# Altium project PCB_Project_POW.PrjPcb (part 1 of 2)
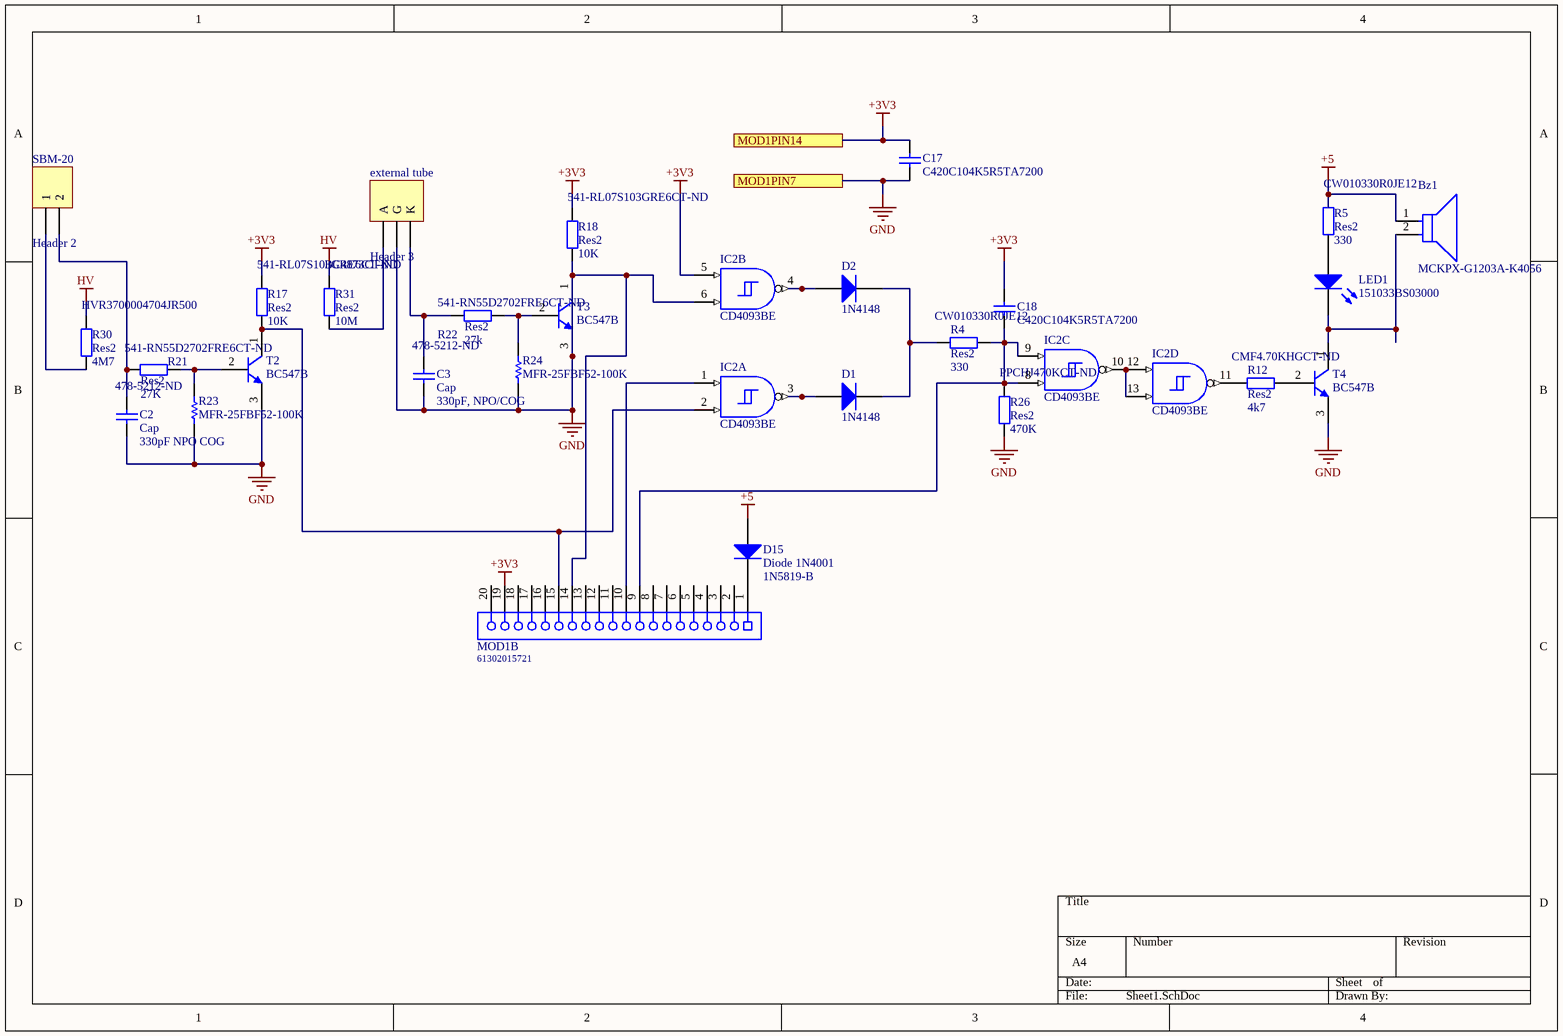
[diagram p0: Sheet1.SchDoc]
3 sheets, 105 parts. Net scope: flat (ports and power ports of the same name join across sheets).
Board file: PCB1.PcbDoc
Sheets:
  Sheet1.SchDoc
  Sheet2.SchDoc
  Sheet3.SchDoc

## Sheet Sheet1.SchDoc
size A4; SheetNumber: 1; SheetTotal: 2

### Parts
Bz1  MCKPX-G1203A-K4056  [FP-MCKPX-G1203A-K4056-MFG]
C2  Cap  value 330pF NPO COG  Supplier Part Number 1: 478-5212-ND  [RAD-0.3]
C3  Cap  value 330pF, NPO/COG  Supplier Part Number 1: 478-5212-ND  [RAD-0.3]
C17  C420C104K5R5TA7200  [KEMT-C420C104K5R5TA7200-2]
C18  C420C104K5R5TA7200  [KEMT-C420C104K5R5TA7200-2]
D1  1N4148  [NXP-SOD27-2_V]
D2  1N4148  [NXP-SOD27-2_V]
D15  Diode 1N4001  Supplier Part Number 1: 1N5819-B  [DO-41]
external_tube  Header 3  [HDR1X3]
IC2  CD4093BE  [N0014A]  (parts A,B,C,D of 5)
LED1  151033BS03000  [Type 3mm]
MOD1B  61302015721  [61302015721]
R4  Res2  value 330  Supplier Part Number 1: CW010330R0JE12  [AXIAL-0.4]
R5  Res2  value 330  Supplier Part Number 1: CW010330R0JE12  [AXIAL-0.4]
R12  Res2  value 4k7  Supplier Part Number 1: CMF4.70KHGCT-ND  [AXIAL-0.4]
R17  Res2  value 10K  Supplier Part Number 1: 541-RL07S103GRE6CT-ND  [AXIAL-0.4]
R18  Res2  value 10K  Supplier Part Number 1: 541-RL07S103GRE6CT-ND  [AXIAL-0.4]
R21  Res2  value 27K  Supplier Part Number 1: 541-RN55D2702FRE6CT-ND  [AXIAL-0.4]
R22  Res2  value 27k  Supplier Part Number 1: 541-RN55D2702FRE6CT-ND  [AXIAL-0.4]
R23  MFR-25FBF52-100K  [RESA60-630X240]
R24  MFR-25FBF52-100K  [RESA60-630X240]
R26  Res2  value 470K  Supplier Part Number 1: PPCHJ470KCT-ND  [AXIAL-0.4]
R30  Res2  value 4M7  Supplier Part Number 1: HVR3700004704JR500  [AXIAL-0.4]
R31  Res2  value 10M  Supplier Part Number 1: BC4873CT-ND  [AXIAL-0.4]
SBM-20  Header 2  [HDR1X2]
T2  BC547B  [ONSC-TO-92-3-29-11]
T3  BC547B  [ONSC-TO-92-3-29-11]
T4  BC547B  [ONSC-TO-92-3-29-11]

### Ports
MOD1PIN7, MOD1PIN14

### Nets
+3V3: C17.2 C18.2 IC2.5(C) MOD1B.19 R17.2 R18.2 ; port MOD1PIN14
+5: Bz1.1(C) C2.1 C3.1 C17.1 D15.1(A) external_tube.G IC2.6(D) MOD1B.14 R5.1 R18.1 R23.1 R24.1 R26.1 T2.3(E) T3.1(C) T3.3(E) T4.3(E) ; port MOD1PIN7  [also labelled GND]
HV: R30.2 R31.2
NetBz1_2: Bz1.2(A) LED1.1(K) T4.1(C)
NetC2_2: C2.2 R21.1 SBM-20.2
NetC3_2: C3.2 external_tube.K R22.1
NetC18_1: C18.1 IC2.8(F) IC2.9(E) MOD1B.9 R4.2 R26.2
NetD1_1: D1.1(A) IC2.3(J)
NetD1_2: D1.2(K) D2.2(K) R4.1
NetD2_1: D2.1(A) IC2.4(K)
NetD15_2: D15.2(K) MOD1B.1
Netexternal_tube_A: external_tube.A R31.1
NetIC2_1: IC2.1(A) MOD1B.10
NetIC2_2: IC2.2(B) MOD1B.15 R17.1 T2.1(C)
NetIC2_10: IC2.10(L) IC2.12(G) IC2.13(H)
NetIC2_11: IC2.11(M) R12.1
NetLED1_2: LED1.2(A) R5.2
NetR12_2: R12.2 T4.2(B)
NetR21_2: R21.2 R23.2 T2.2(B)
NetR22_2: R22.2 R24.2 T3.2(B)
NetR30_1: R30.1 SBM-20.1

Not connected (* = marked no-connect by the designer): MOD1B 2 3 4 5 6 7 8 11 12 13 16 17 18 20

### Library data of the parts
Bz1 = CMP-12433-000001-1: MAGNETIC BUZZER AND TRANSDUCER - More Details; Manufacturer: Multicomp Pro; Operating Supply Voltage: 3V; Current: 30mA; Frequency: 2300Hz; Max Supply Voltage: 5V; Min Supply Voltage: 2V; Standoff Height: 0.5mm; ComponentLink2Description: Datasheet; ComponentLink2URL: http://www.farnell.com/datasheets/1498149.pdf?_ga=2.17855225.1157923166.1572356775-536200964.1569240579; Manufacturer Part Number: MCKPX-G1203A-K4056; Temperature Range High: +70°C; Device Class L2: Audio Products; Temperature Range Low: -20°C; Package: 0; Temperature: -20°C to +70°C; Category: Speak; Octopart: https://octopart.com/mckpx-g1203a-k4056-multicomp-12157154; RoHS: TRUE; Lead Free: Yes; Height: 9.5mm; Device Class L1: Electromechanical; Automotive: No; Device Class L3: Buzzers
C2 C3 = Cap: Multilayer Ceramic Capacitor, 330 pF, 100 V,  5%, Radial Leaded, C0G / NP0; Manufacturer: Kyocera AVX; Manufacturer Part Number: SR151A331JAR; Capacitance: 330pF; Voltage Rating: 100V; Voltage Rating (DC): 50V; Lead/Base Style: Straight; Temperature Coefficient: 30ppm/°C; Lead Diameter: 0.508mm; Published: 8-Jun-2000; LatestRevisionDate: 17-Jul-2002; LatestRevisionNote: Re-released for DXP Platform.; PackageReference: RAD-0.3; Publisher: Altium Limited; PackageDescription: Radial Cap, Thru-Hole; 2 Leads; 0.3 in Pin Spacing; Supplier 1: Digi-Key; RoHS: Yes; Category: Ceramic Capacitors; Stock 1: 1456; Pricing 1: 1=0,63000, 10=0,44200, 50=0,33420, 100=0,29110, 500=0,21560, 1000=0,18326, 2500=0,17248, 5000=0,16170 (USD); Mount: Through Hole,PCB; Case/Package: Dipped; Number of Pins: 2; Contact Plating: Tin,Matte; Min Operating Temperature: -55°C; Max Operating Temperature: 125°C; Tolerance: 5%; Packaging: Bulk; Dielectric: C0G; Termination: Radial; Package Quantity: 1000; Resistor Type: Ceramic; Voltage: 100V; Length: 3.81mm; Width: 0.1inch; Height: 3.81mm; Lead Pitch: 2.54mm; Thickness: 2.54mm; Depth: 2.54mm; Height - Seated (Max): 0.15inch; Radiation Hardening: No; RoHS Compliant: Yes; Lead Free: Lead Free; REACH SVHC: No SVHC; ComponentLink1URL: https://datasheet.ciiva.com/11787/0900766b8064818e-11787697.pdf?src-supplier=RSComponents; ComponentLink1Description: https://datasheet.ciiva.com/11787/0900766b8064818e-11787697.pdf?src-supplier=RSComponents; ComponentLink2URL: https://datasheet.ciiva.com/27051/1129391-27051478.pdf?src-supplier=Jameco; ComponentLink2Description: https://datasheet.ciiva.com/27051/1129391-27051478.pdf?src-supplier=Jameco; ComponentLink3URL: https://datasheet.ciiva.com/154/skycap-154577.pdf?src-supplier=Digi-Key; ComponentLink3Description: https://datasheet.ciiva.com/154/skycap-154577.pdf?src-supplier=Digi-Key; ComponentLink4URL: https://datasheet.ciiva.com/16391/skycap-sr-16391048.pdf?src-supplier=Future+Electronics; ComponentLink4Description: https://datasheet.ciiva.com/16391/skycap-sr-16391048.pdf?src-supplier=Future+Electronics; ComponentLink5URL: https://datasheet.ciiva.com/14587/70195658-14587500.pdf?src-supplier=Allied+Electronics; ComponentLink5Description: https://datasheet.ciiva.com/14587/70195658-14587500.pdf?src-supplier=Allied+Electronics; ComponentLink6URL: https://datasheet.ciiva.com/22620/210648-22620069.pdf?src-supplier=Element14; ComponentLink6Description: https://datasheet.ciiva.com/22620/210648-22620069.pdf?src-supplier=Element14; ComponentLink7URL: https://datasheet.ciiva.com/5389/skycap-sr-8826-5389254.pdf?src-supplier=Mouser; ComponentLink7Description: https://datasheet.ciiva.com/5389/skycap-sr-8826-5389254.pdf?src-supplier=Mouser
C17 C18 = CMP-2000-05175-1: CAP, Ceramic, 0.1 uF, +/- 10%, 50 V, -55 to 125 degC, 2-Pin THD, RoHS, Tape and Reel; Manufacturer: KEMET; Capacitance Value: 0.1uF; Dielectric: X7R; Product Diameter: 2.54(Max)mm; Rad Hard: No; Product Length: 6.6(Max)mm; Voltage: 50Vdc; Tolerance: 10%; Package Description: 3-Pin Through Hole Device, Body 7.36 x 2.54 mm, Pitch 11.04 mm; Category: CapacitorCeramicMultilayer; Operating Temperature: -55to125degC; Termination Style: Axial; Manufacturer URL: http://www.kemet.com/; Mounting: ThroughHole; Datasheet URL: http://www.mouser.com/ds/2/212/Kemet_C410-412-420-364989.pdf; Package/Case: 2.54(Max)X6.6(Max); Datasheet Version: Aug-14
D1 D2 = CMP-0648-00002-1: High-speed Diode, 100 V, 450 mA, 2-Pin SOD27, RoHS; Manufacturer: NXP Semiconductors; Configuration: Single; IR (VR: 20 V)=25 nA; IFRM: 450 mA; IFSM: 4 A Max.; Trr: 4 ns Max.; Cd: 4 pF Max.; VR: 100 V Max.; VF (IF: 10 mA)=1 V; IF: 200 mA Max.; ComponentLink1Description: Manufacturer URL; RoHS: TRUE; ComponentLink1URL: http://www.nxp.com/; ComponentLink3Description: Package Specification; DatasheetVersion: Aug-04; ComponentLink2Description: Datasheet; PackageVersion: Aug-04; PackageReference: SOD27; ComponentLink3URL: http://www.nxp.com/documents/data_sheet/1N4148_1N4448.pdf; Mounting Technology: Through Hole; ComponentLink2URL: http://www.nxp.com/documents/data_sheet/1N4148_1N4448.pdf; PartNumber: 1N4148; PackageDescription: 2-Pin Hermetically Sealed Glass Package, Axial Leaded, Dia 1.85 mm, Body Length 4.25 mm, Lead Spread 25.4 mm
D15 = Diode 1N4001: Diode Schottky 40V 1A 2-Pin DO-41 Bulk; Manufacturer: Diodes Zetex; Forward Voltage: 900mV; Max Reverse Current: 1mA; Element Configuration: Single; Peak Non-Repetitive Surge Current: 25A; Published: 8-Jun-2000; LatestRevisionDate: 17-Jul-2002; LatestRevisionNote: Re-released for DXP Platform.; DatasheetVersion: 1998; PackageVersion: Aug-1999; PackageReference: DO-41; Publisher: Altium Limited; PackageDescription: Diode, Axial; Body 5.2 x 2.7 mm (LxDia. max), Lead Dia. 0.86 mm (max); Code_JEDEC: DO-204-AL; ComponentLink1Description: Manufacturer Link; ComponentLink1URL: http://www.fairchildsemi.com/; ComponentLink2Description: Datasheet; ComponentLink2URL: http://www.fairchildsemi.com/ds/1N%2F1N4001.pdf; Supplier 1: Avnet; Manufacturer Part Number: 1N5819-B; RoHS: Yes; Category: Rectifier Diodes; Pricing 1: 1000=0,03882, 2000=0,03743, 4000=0,03631, 6000=0,03525, 8000=0,03392, 10000=0,03339, 100000=0,03286 (USD); Mount: Through Hole; Case/Package: DO-41; Number of Pins: 2; Weight: 0.010935oz; Contact Plating: Tin; Min Operating Temperature: -65°C; Max Operating Temperature: 125°C; Packaging: Bulk; Average Rectified Current: 1A; Package Quantity: 1000; Max Repetitive Reverse Voltage (Vrrm): 40V; Max Reverse Voltage (DC): 40V; Forward Current: 1A; Max Forward Surge Current (Ifsm): 25A; Series: 1N58; Length: 5.21mm; Width: 2.72mm; Height: 2.72mm; Radiation Hardening: No; RoHS Compliant: Yes; ComponentLink3URL: https://datasheet.ciiva.com/912/ds23001-912768.pdf?src-supplier=Avnet; ComponentLink3Description: https://datasheet.ciiva.com/912/ds23001-912768.pdf?src-supplier=Avnet
external_tube = Header 3: Header, 3-Pin; LatestRevisionDate: 17-Jul-2002; LatestRevisionNote: Re-released for DXP Platform.; Publisher: Altium Limited
IC2 = CMP-1627-00493-3: CMOS Quad 2-Input NAND Schmitt Triggers, N0014A, TUBE; Manufacturer: Texas Instruments; ICC @ Nom Voltage(Max)(mA): 0.06; VCC(Min)(V): 3; Rating: Catalog; Bits(#): 4; Technology Family: CD4000; Output Drive (IOL/IOH)(Max)(mA): 1.5/-1.5; VCC(Max)(V): 18; Voltage(Nom)(V): 10; Schmitt Trigger: Yes; F @ Nom Voltage(Max)(Mhz): 8; DatasheetVersion: SCHS115D; PackageReference: N0014A; Code_JEDEC: MS-001; Output Type: CMOS; Input Type: CMOS; Generic Part Number: CD4093B; Operating Temperature Range(C): -55 to 125
LED1 = CMP-1489-00002-1: THT LED round mono-color waterclear, WL-TMRW , Blue; Manufacturer: Wuerth Elektronik; ComponentLink2URL: http://katalog.we-online.de/pbs/datasheet/7448042001.pdfhttp://katalog.we-online.de/pbs/datasheet/7448042001.pdfhttp://katalog.we-online.de/pbs/datasheet/7448042001.pdfhttp://katalog.we-online.de/pbs/datasheet/151033BS03000.pdf; ComponentLink1Description: Manufacturer URL; Emitting color: Blue; PackageReference: Type 3mm; ComponentLink2Description: Datasheet; PartNumber: 151033BS03000; ComponentLink1URL: http://www.we-online.com
MOD1B = CMP-1502-01349-1: THT Vertical Socket Header WR-PHD, Pitch 2.54 mm, Single Row, 20 pins; Manufacturer: Wurth Elektronik; Withstanding Voltage: 500VAC; Working Voltage: 250VAC; Rated Current: 3A; Gender: Female; Pitch: 2.54mm; Contact Resistance: 20mOhm; Pin Number: 20; Operating Temperature: -40to125degC; Manufacturer URL: http://www.we-online.de; Datasheet URL: https://katalog.we-online.de/em/datasheet/6130xx15721.pdf; Row Number: Single; Packaging: Tube; Orientation: Vertical; Publisher: WurthElektronik; Package Reference: 61302015721; Mounting Technology: THT; Part Number: 61302015721
R4 R5 = Res2: Wirewound Resistors 10watts 330ohms 5%; Manufacturer: Vishay Dale; Resistance: 330R; Power Rating: 10W; Temperature Coefficient: 30ppm/°C; Lead Diameter: 1.02mm; Published: 8-Jun-2000; LatestRevisionDate: 17-Jul-2002; LatestRevisionNote: Re-released for DXP Platform.; PackageReference: AXIAL-0.4; Publisher: Altium Limited; PackageDescription: Axial Device, Thru-Hole; 2 Leads; 0.4 in Pin Spacing; Supplier 1: Avnet; Manufacturer Part Number: CW010330R0JE12; RoHS: Yes; Category: Through-Hole Resistors; Pricing 1: 100=1,22562, 200=1,19564, 400=1,09480, 600=1,06352, 800=1,04006, 1000=1,01660, 10000=0,99314 (USD); Mount: Through Hole; Case/Package: Axial; Weight: 0.317466oz; Contact Plating: Tin,Matte; Min Operating Temperature: -65°C; Max Operating Temperature: 250°C; Tolerance: 5%; Resistor Type: Wirewound; Packaging: Bulk; Package Quantity: 100; Number of Terminations: 2; Termination: Axial; Max Power Dissipation: 10W; Features: Moisture Resistant; Diameter: 9.52mm; Length: 47.62mm; Radiation Hardening: No; Military Standard: Not; ComponentLink1URL: https://datasheet.ciiva.com/8453/cw-8453255.pdf?src-supplier=Avnet; ComponentLink1Description: https://datasheet.ciiva.com/8453/cw-8453255.pdf?src-supplier=Avnet; ComponentLink2URL: https://datasheet.ciiva.com/2761/cw-2761098.pdf?src-supplier=Digi-Key; ComponentLink2Description: https://datasheet.ciiva.com/2761/cw-2761098.pdf?src-supplier=Digi-Key
R12 = Res2: METAL FILM RESISTOR, 4.7KOHM, 500mW, 1%; Product Range:CMF Series; Resistance:4.7kohm; Power Rating:500mW; Resistance Tolerance: 1%; Voltage Rating:250V; Resistor Case Style:Axial Leaded; Resistor Element Type:Metal Film ;RoHS Compliant: Yes; Manufacturer: Vishay Dale; Manufacturer Part Number: CMF554K7000FKEB; Resistance: 4.7kR; Temperature Coefficient: 100ppm/°C; Voltage Rating: 250V; Lead Diameter: 0.64mm; Published: 8-Jun-2000; LatestRevisionDate: 17-Jul-2002; LatestRevisionNote: Re-released for DXP Platform.; PackageReference: AXIAL-0.4; Publisher: Altium Limited; PackageDescription: Axial Device, Thru-Hole; 2 Leads; 0.4 in Pin Spacing; Supplier 1: Digi-Key; RoHS: Yes; Category: Through-Hole Resistors; Stock 1: 1586; Pricing 1: 1=0,53000, 10=0,40700, 25=0,30960, 50=0,23000, 100=0,17110, 250=0,14456, 500=0,12390 (USD); Case/Package: Axial; Number of Pins: 2; Contact Plating: Tin,Matte; Weight: 0.009877oz; Min Operating Temperature: -55°C; Max Operating Temperature: 175°C; Tolerance: 1%; Power Rating: 500mW; Resistor Type: Metal Film; Packaging: Tape and Reel; Package Quantity: 1; Number of Terminations: 2; Max Power Dissipation: 500mW; Termination: Axial; Voltage Rating (DC): 250V; Features: Moisture Resistant,Flame Retardant Coating; Series: CMF; Diameter: 2.29mm; Length: 6.1mm; Width: 2.29mm; REACH SVHC: Unknown; RoHS Compliant: Yes; Lead Free: Lead Free; ComponentLink1URL: https://datasheet.ciiva.com/8821/cmfind-8821141.pdf?src-supplier=Avnet; ComponentLink1Description: https://datasheet.ciiva.com/8821/cmfind-8821141.pdf?src-supplier=Avnet; ComponentLink2URL: https://datasheet.ciiva.com/6532/cmfind-6532695.pdf?src-supplier=Digi-Key; ComponentLink2Description: https://datasheet.ciiva.com/6532/cmfind-6532695.pdf?src-supplier=Digi-Key; ComponentLink3URL: https://datasheet.ciiva.com/6532/cmfind-6532697.pdf?src-supplier=Digi-Key; ComponentLink3Description: https://datasheet.ciiva.com/6532/cmfind-6532697.pdf?src-supplier=Digi-Key; ComponentLink4URL: https://datasheet.ciiva.com/16436/cmfind-16436747.pdf?src-supplier=Future+Electronics; ComponentLink4Description: https://datasheet.ciiva.com/16436/cmfind-16436747.pdf?src-supplier=Future+Electronics
R17 R18 = Res2: Metal Film Resistors 1/4watt 10Kohms 2%; Manufacturer: Vishay Dale; Manufacturer Part Number: RL07S103GRE6; Resistance: 10kR; Max Power Dissipation: 250mW; Temperature Coefficient: 200ppm/°C; Voltage Rating: 250V; Published: 8-Jun-2000; LatestRevisionDate: 17-Jul-2002; LatestRevisionNote: Re-released for DXP Platform.; PackageReference: AXIAL-0.4; Publisher: Altium Limited; PackageDescription: Axial Device, Thru-Hole; 2 Leads; 0.4 in Pin Spacing; Supplier 1: Digi-Key; RoHS: No; Category: Through-Hole Resistors; Stock 1: 976; Pricing 1: 1=0,66000, 10=0,47000, 25=0,36640, 50=0,31020, 100=0,24440, 250=0,20680, 500=0,16920 (USD); Mount: Through Hole; Case/Package: Axial; Contact Plating: Tin,Lead; Min Operating Temperature: -65°C; Max Operating Temperature: 175°C; Tolerance: 2%; Packaging: Tape and Reel; Resistor Type: Metal Film; Number of Terminations: 2; Package Quantity: 1000; Power Rating: 250mW; Series: Military, MIL-PRF-22684/01, RL07; Termination: Axial; Features: Moisture Resistant,Military,Flame Retardant Coating; Diameter: 2.29mm; Length: 0.24inch; Width: 2.29mm; RoHS Compliant: No; Lead Free: Contains Lead; Military Standard: MIL-PRF-22684; ComponentLink1URL: https://datasheet.ciiva.com/14072/cmfmil-14072105.pdf?src-supplier=Digi-Key; ComponentLink1Description: https://datasheet.ciiva.com/14072/cmfmil-14072105.pdf?src-supplier=Digi-Key
R21 R22 = Res2: RES 27K OHM 1/8W 1% AXIAL; Manufacturer: Vishay Dale; Manufacturer Part Number: RN55D2702FRE6; Resistance: 27kR; Max Power Dissipation: 125mW; Temperature Coefficient: 100ppm/°C; Voltage Rating: 200V; Lead Diameter: 0.64mm; Published: 8-Jun-2000; LatestRevisionDate: 17-Jul-2002; LatestRevisionNote: Re-released for DXP Platform.; PackageReference: AXIAL-0.4; Publisher: Altium Limited; PackageDescription: Axial Device, Thru-Hole; 2 Leads; 0.4 in Pin Spacing; Supplier 1: Digi-Key; RoHS: No; Category: Through-Hole Resistors; Stock 1: 127; Pricing 1: 1=0,53000, 10=0,40700, 25=0,30960, 50=0,23000, 100=0,17110, 250=0,14456, 500=0,12390 (USD); Case/Package: Axial; Min Operating Temperature: -65°C; Max Operating Temperature: 175°C; Tolerance: 1%; Resistor Type: Metal Film; Packaging: Tape and Reel; Number of Terminations: 2; Package Quantity: 1000; Power Rating: 125mW; Features: Moisture Resistant,Military,Flame Retardant Coating; Series: Military, MIL-R-10509/7, RN55; Termination: Axial; Length: 0.24inch; Width: 2.29mm; RoHS Compliant: No; Lead Free: Contains Lead; ComponentLink1URL: https://datasheet.ciiva.com/14071/cmfmil-14071638.pdf?src-supplier=Digi-Key; ComponentLink1Description: https://datasheet.ciiva.com/14071/cmfmil-14071638.pdf?src-supplier=Digi-Key
R23 R24 = CMP-1659-00073-1: Axial Resistor, 100 KOhm, +/- 1%, 0.25 W, -55 to 155 degC, 2-Pin THD, RoHS, Bulk; Voltage Rating: 250 V; Power Rating: 250 mW; Resistance: 475 Ohm; PackageDescription: 2-Pin Axial Lead, Dia 2.4 mm, Body Length 6.3 mm; PackageReference: MFR-25; Length: 0.248 inch; ComponentLink2Description: Datasheet; Packaging: Bulk; DatasheetVersion: Apr-13; Package Quantity: 200; Min Operating Temperature: -55 degC; ComponentLink2URL: http://www.yageo.com/documents/recent/Yageo%20LR_MFR_2013.pdf; RoHSCompliant: true; ComponentLink1URL: http://www.yageo.com/; Tolerance: 1%; Case\Package: Axial; Mount: Through Hole; ComponentLink1Description: Manufacturer URL; Max Operating Temperature: 155 degC
R26 = Res2: RES 470K OHM 1/2W 5% AXIAL; Manufacturer: Vishay BCcomponents; Manufacturer Part Number: HVR3700004703JR500; Resistance: 470kR; Power Rating: 500mW; Temperature Coefficient: 200ppm/°C; Voltage Rating: 3.5kV; Published: 8-Jun-2000; LatestRevisionDate: 17-Jul-2002; LatestRevisionNote: Re-released for DXP Platform.; PackageReference: AXIAL-0.4; Publisher: Altium Limited; PackageDescription: Axial Device, Thru-Hole; 2 Leads; 0.4 in Pin Spacing; Supplier 1: Digi-Key; RoHS: Yes; Category: Through-Hole Resistors; Stock 1: 3725; Pricing 1: 1=0,54000, 10=0,41100, 25=0,31280, 50=0,23240, 100=0,17280, 250=0,14600, 500=0,12516, 1000=0,09536 (USD); Case/Package: Axial; Number of Pins: 2; Min Operating Temperature: -55°C; Max Operating Temperature: 155°C; Tolerance: 5%; Resistor Type: Metal Film; Packaging: Tape and Reel; Number of Terminations: 2; Max Power Dissipation: 500mW; Series: HVR37; Voltage Rating (DC): 3.5kV; Package Quantity: 1; Resistance Tolerance: 5%; Features: Flame Retardant Coating; Length: 0.394inch; RoHS Compliant: Yes; REACH SVHC: Unknown; Lead Free: Lead Free; ComponentLink1URL: https://datasheet.ciiva.com/2711/hvr2537-2711908.pdf?src-supplier=Digi-Key; ComponentLink1Description: https://datasheet.ciiva.com/2711/hvr2537-2711908.pdf?src-supplier=Digi-Key; ComponentLink2URL: https://datasheet.ciiva.com/2711/hvr2537-2711909.pdf?src-supplier=Digi-Key; ComponentLink2Description: https://datasheet.ciiva.com/2711/hvr2537-2711909.pdf?src-supplier=Digi-Key
R30 = Res2: RES 4.7M OHM 1/2W 5% AXIAL; Manufacturer: Vishay BCcomponents; Resistance: 4.7MR; Max Power Dissipation: 500mW; Temperature Coefficient: 200ppm/°C; Voltage Rating: 3.5kV; Published: 8-Jun-2000; LatestRevisionDate: 17-Jul-2002; LatestRevisionNote: Re-released for DXP Platform.; PackageReference: AXIAL-0.4; Publisher: Altium Limited; PackageDescription: Axial Device, Thru-Hole; 2 Leads; 0.4 in Pin Spacing; Supplier 1: Arrow Electronics; Manufacturer Part Number: HVR3700004704JR500; RoHS: Yes; Category: Through-Hole Resistors; Stock 1: 1607; Pricing 1: 1=0,55200, 10=0,42080, 25=0,31700, 50=0,23310, 100=0,17160, 250=0,14340, 500=0,12170, 1000=0,09170, 5000=0,07430, 1=0,25800, 10=0,19670, 25=0,14820, 100=0,08110, 250=0,08040, 500=0,07960, 1000=0,07890 (USD); Case/Package: Axial; Number of Pins: 2; Min Operating Temperature: -55°C; Max Operating Temperature: 155°C; Tolerance: 5%; Resistor Type: Metal Film; Packaging: Tape and Reel; Number of Terminations: 2; Series: HVR37; Package Quantity: 1; Power Rating: 500mW; Voltage Rating (DC): 3.5kV; Features: Flame Retardant Coating; Resistance Tolerance: 5%; Length: 0.394inch; RoHS Compliant: Yes; REACH SVHC: Unknown; Lead Free: Lead Free; ComponentLink1URL: https://datasheet.ciiva.com/2711/hvr2537-2711956.pdf?src-supplier=Digi-Key; ComponentLink1Description: https://datasheet.ciiva.com/2711/hvr2537-2711956.pdf?src-supplier=Digi-Key; ComponentLink2URL: https://datasheet.ciiva.com/2711/hvr2537-2711957.pdf?src-supplier=Digi-Key; ComponentLink2Description: https://datasheet.ciiva.com/2711/hvr2537-2711957.pdf?src-supplier=Digi-Key; ComponentLink3URL: https://datasheet.ciiva.com/7836/653840-7836134.pdf?src-supplier=Element14; ComponentLink3Description: https://datasheet.ciiva.com/7836/653840-7836134.pdf?src-supplier=Element14
R31 = Res2: Metal Film Resistors - Through Hole 1/4watt 1.5Mohms 5%; Manufacturer: Vishay; Manufacturer Part Number: VR25000001504JA100; Power Rating: 250mW; Resistance: 1.5MR; Voltage Rating: 1.6kV; Temperature Coefficient: 200ppm/°C; Published: 8-Jun-2000; LatestRevisionDate: 17-Jul-2002; LatestRevisionNote: Re-released for DXP Platform.; PackageReference: AXIAL-0.4; Publisher: Altium Limited; PackageDescription: Axial Device, Thru-Hole; 2 Leads; 0.4 in Pin Spacing; Supplier 1: Digi-Key; RoHS: Yes; Category: Through-Hole Resistors; Stock 1: 10358; Pricing 1: 1=0,42000, 10=0,30200, 25=0,22320, 50=0,16440, 100=0,12080, 250=0,09976, 500=0,08224 (USD); Mount: Through Hole; Case/Package: Conformal; Contact Plating: Tin; Min Operating Temperature: -55°C; Max Operating Temperature: 155°C; Tolerance: 5%; Termination: Axial; Packaging: Ammo Pack; Series: VR25; Construction: Cylindrical; Diameter: 2.5mm; Length: 7.5mm; Radiation Hardening: No; Military Standard: Not; RoHS Compliant: Yes; ComponentLink1URL: https://datasheet.ciiva.com/11825/0900766b80d81dee-11825367.pdf?src-supplier=RSComponents; ComponentLink1Description: https://datasheet.ciiva.com/11825/0900766b80d81dee-11825367.pdf?src-supplier=RSComponents; ComponentLink2URL: https://datasheet.ciiva.com/8394/vr25-8394076.pdf?src-supplier=Avnet; ComponentLink2Description: https://datasheet.ciiva.com/8394/vr25-8394076.pdf?src-supplier=Avnet; ComponentLink3URL: https://datasheet.ciiva.com/17051/vr25-17051452.pdf?src-supplier=Avnet+Europe; ComponentLink3Description: https://datasheet.ciiva.com/17051/vr25-17051452.pdf?src-supplier=Avnet+Europe
SBM-20 = Header 2: Header, 2-Pin; LatestRevisionDate: 17-Jul-2002; LatestRevisionNote: Re-released for DXP Platform.; Publisher: Altium Limited
T2-T4 = CMP-1048-01467-1: Amplifier Transistor, NPN Silicon, 3-Pin TO-92, Bulk Box; Manufacturer: On Semiconductor; IC Continuous (A): 0.1; fT Min (MHz): 150; DatasheetVersion: Rev. 7; ComponentLink1URL: http://www.onsemi.com/; Polarity: NPN; RoHS: FALSE; ComponentLink1Description: Manufacturer URL; Packing: Bulk Box; PackageDescription: 3-Pin Transistor Outline, Body 4.825 x 3.685 mm, Pitch 1.27 mm; ComponentLink3URL: http://www.onsemi.cn/pub_link/Collateral/2N6426-D.PDF; ComponentLink2Description: Datasheet; PackageVersion: Rev. AM; PackageReference: TO-92-3-29-11_AM_SL; ComponentLink3Description: Package Specification; Mounting Technology: Through Hole; PartNumber: BC547B; ComponentLink2URL: http://www.onsemi.com/pub_link/Collateral/BC546-D.PDF

## Sheet Sheet2.SchDoc
size A4; SheetNumber: 2; SheetTotal: 3
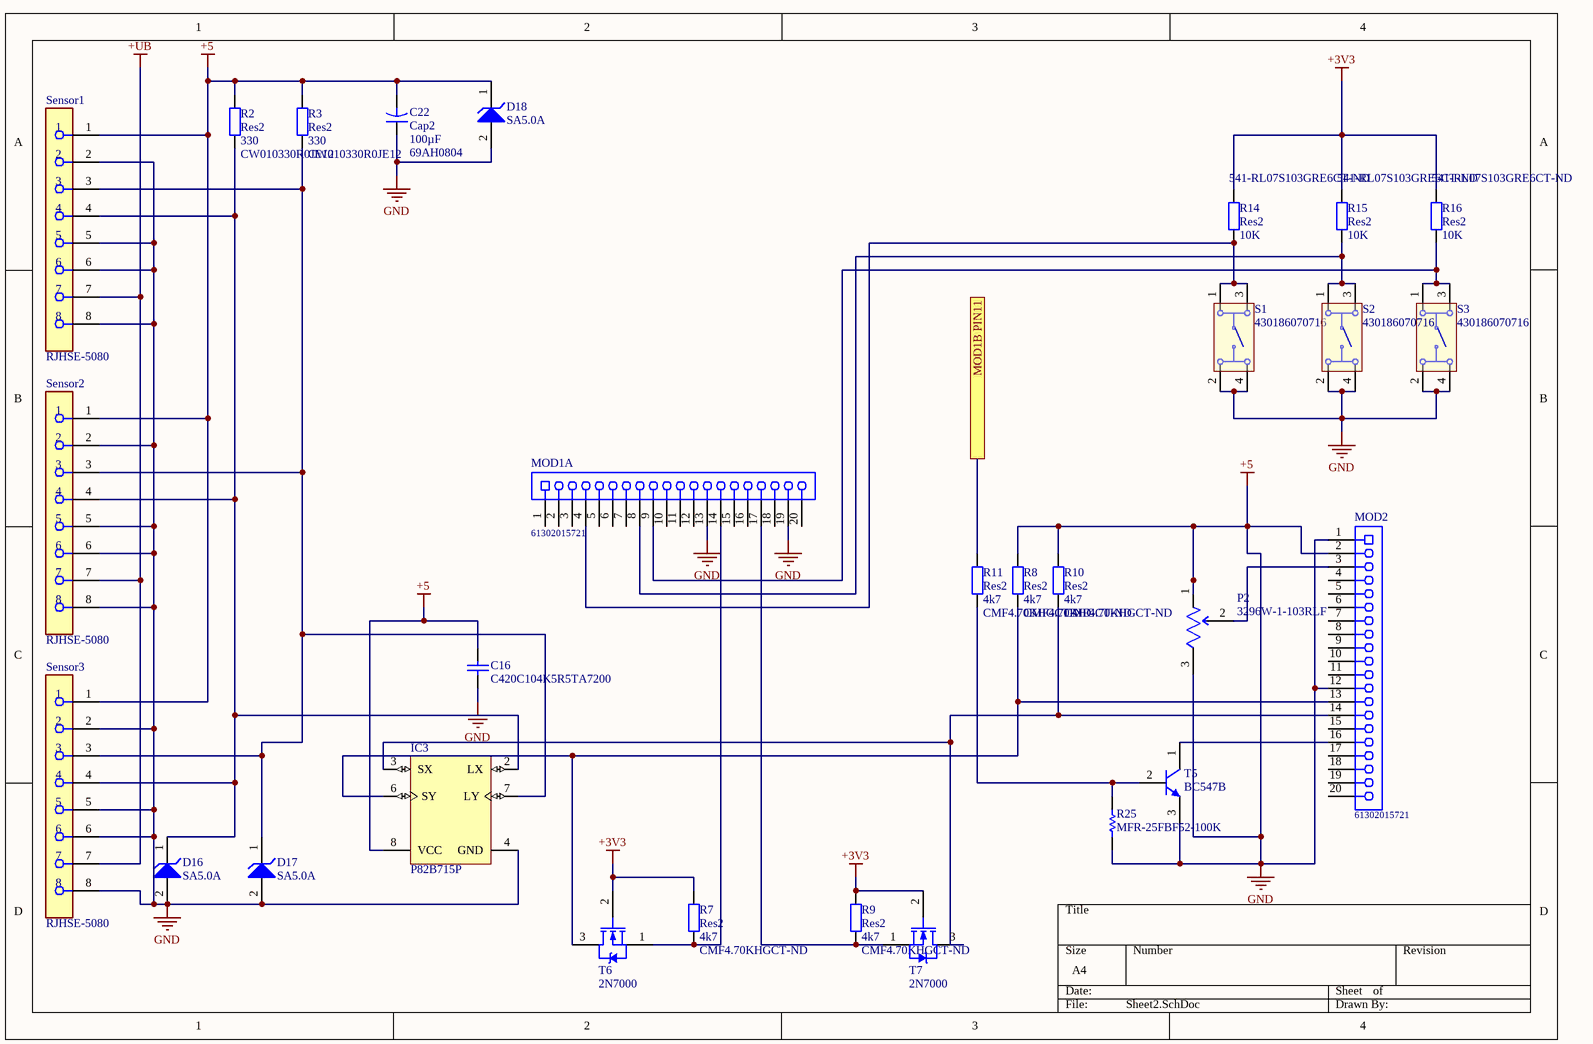
[diagram p1: Sheet2.SchDoc]

### Parts
C16  C420C104K5R5TA7200  [KEMT-C420C104K5R5TA7200-2]
C22  Cap2  value 100µF  Supplier Part Number 1: 69AH0804  [CAPR5-4X5]
D16  SA5.0A  [ONSC-AXIAL_LEAD-2-59AA-01_P]
D17  SA5.0A  [ONSC-AXIAL_LEAD-2-59AA-01_P]
D18  SA5.0A  [ONSC-AXIAL_LEAD-2-59AA-01_P]
IC3  P82B715P  [P0008A]
MOD1A  61302015721  [61302015721]
MOD2  61302015721  [61302015721]
P2  3296W-1-103RLF  [FP-3296W-MFG]
R2  Res2  value 330  Supplier Part Number 1: CW010330R0JE12  [AXIAL-0.4]
R3  Res2  value 330  Supplier Part Number 1: CW010330R0JE12  [AXIAL-0.4]
R7  Res2  value 4k7  Supplier Part Number 1: CMF4.70KHGCT-ND  [AXIAL-0.4]
R8  Res2  value 4k7  Supplier Part Number 1: CMF4.70KHGCT-ND  [AXIAL-0.4]
R9  Res2  value 4k7  Supplier Part Number 1: CMF4.70KHGCT-ND  [AXIAL-0.4]
R10  Res2  value 4k7  Supplier Part Number 1: CMF4.70KHGCT-ND  [AXIAL-0.4]
R11  Res2  value 4k7  Supplier Part Number 1: CMF4.70KHGCT-ND  [AXIAL-0.4]
R14  Res2  value 10K  Supplier Part Number 1: 541-RL07S103GRE6CT-ND  [AXIAL-0.4]
R15  Res2  value 10K  Supplier Part Number 1: 541-RL07S103GRE6CT-ND  [AXIAL-0.4]
R16  Res2  value 10K  Supplier Part Number 1: 541-RL07S103GRE6CT-ND  [AXIAL-0.4]
R25  MFR-25FBF52-100K  [RESA60-630X240]
S1  430186070716  [430186070716]
S2  430186070716  [430186070716]
S3  430186070716  [430186070716]
Sensor1  RJHSE-5080  [FP-RJHSE-5080-MFG]
Sensor2  RJHSE-5080  [FP-RJHSE-5080-MFG]
Sensor3  RJHSE-5080  [FP-RJHSE-5080-MFG]
T5  BC547B  [ONSC-TO-92-3-29-11]
T6  2N7000  [ONSC-TO-92-3-29-11]
T7  2N7000  [ONSC-TO-92-3-29-11]

### Ports
MOD1B PIN11

### Nets
+3V3: R7.2 R9.1 R14.2 R15.2 R16.2 T6.2(G) T7.2(G)
+5: C16.1 C16.2 C22.1 C22.2 D16.2(A) D17.2(A) D18.1(K) D18.2(A) IC3.4(GND) IC3.8(VCC) MOD1A.13 MOD1A.19 MOD2.1 MOD2.2 MOD2.12 P2.1(CCW) P2.3(CW) R2.2 R3.2 R8.1 R10.1 R25.1 S1.2 S1.4 S2.2 S2.4 S3.2 S3.4 Sensor1.1 Sensor1.2 Sensor1.5 Sensor1.6 Sensor1.8 Sensor2.1 Sensor2.2 Sensor2.5 Sensor2.6 Sensor2.8 Sensor3.1 Sensor3.2 Sensor3.5 Sensor3.6 Sensor3.8 T5.3(E)  [also labelled GND]
+UB: Sensor1.7 Sensor2.7 Sensor3.7
NetD16_1: D16.1(K) IC3.2(LX) R2.1 Sensor1.4 Sensor2.4 Sensor3.4
NetD17_1: D17.1(K) IC3.7(LY) R3.1 Sensor1.3 Sensor2.3 Sensor3.3
NetIC3_3: IC3.3(SX) MOD2.14 R10.2 T7.3(D)
NetIC3_6: IC3.6(SY) MOD2.13 R8.2 T6.3(D)
NetMOD1A_4: MOD1A.4 R14.1 S1.1 S1.3
NetMOD1A_8: MOD1A.8 R15.1 S2.1 S2.3
NetMOD1A_9: MOD1A.9 R16.1 S3.1 S3.3
NetMOD1A_14: MOD1A.14 R7.1 T6.1(S)
NetMOD1A_17: MOD1A.17 R9.2 T7.1(S)
NetMOD2_3: MOD2.3 P2.2(WIPER)
NetMOD2_16: MOD2.16 T5.1(C)
NetR11_1: R11.1 ; port MOD1B PIN11
NetR11_2: R11.2 R25.2 T5.2(B)

Not connected (* = marked no-connect by the designer): MOD1A 1 2 3 5 6 7 10 11 12 15 16 18 20; MOD2 4 5 6 7 8 9 10 11 15 17 18 19 20

### Library data of the parts
C16 = CMP-2000-05175-1: as C17 on sheet Sheet1; Tolerance: 10%; Package Description: 3-Pin Through Hole Device, Body 7.36 x 2.54 mm, Pitch 11.04 mm; Category: CapacitorCeramicMultilayer; Operating Temperature: -55to125degC; Termination Style: Axial; Manufacturer URL: http://www.kemet.com/; Mounting: ThroughHole; Datasheet URL: http://www.mouser.com/ds/2/212/Kemet_C410-412-420-364989.pdf; Package/Case: 2.54(Max)X6.6(Max); Datasheet Version: Aug-14
C22 = Cap2: Cap Aluminum 100uF 25V 20% (6.3 X 11mm) Radial 5mm 190mA 2500 hr 85C Ammo Pack; Manufacturer: Vishay BCcomponents; Manufacturer Part Number: MAL203836101E3; Life (Hours): 2500Hour; Leakage Current: 25uA; Dissipation Factor: 0.14%; Lead Diameter: 0.5mm; Published: 23-Sep-2002; PackageReference: CAPR5-4X5; Publisher: Altium Limited; PackageDescription: Capacitor; 2 Leads; Supplier 1: Newark; RoHS: Yes; Category: Aluminum Electrolytic Capacitors; Stock 1: 9020; Pricing 1: 10=0,22900, 25=0,22100, 50=0,21300, 100=0,20400 (USD); Mount: Through Hole; Case/Package: Radial; Weight: 0.021164oz; Min Operating Temperature: -40°C; Max Operating Temperature: 85°C; Capacitance: 100uF; Tolerance: 20%; Voltage Rating: 25V; Packaging: Tape and Reel; Ripple Current: 190mA; Termination: Radial; Package Quantity: 10000; Voltage Rating (DC): 25V; Series: 038 RSU; Diameter: 6.3mm; Length: 11mm; Height: 11mm; Height - Seated (Max): 0.492inch; Lead Pitch: 5mm; Radiation Hardening: No; RoHS Compliant: Yes; ComponentLink1URL: https://datasheet.ciiva.com/11701/038rsu-11701167.pdf?src-supplier=Avnet; ComponentLink1Description: https://datasheet.ciiva.com/11701/038rsu-11701167.pdf?src-supplier=Avnet
D16-D18 = CMP-1061-00012-1: 500 W Peak Power, MiniMOSORB(TM) Zener Transient Voltage Suppressor, Unidirectional, 2-Pin Axial_Lead, Bulk Box; Manufacturer: On Semiconductor; V(BR) Typ (V): 6.7; IR Max (uA): 600; PPK Max (W): 500; Mounting Technology: Through Hole; ComponentLink3URL: http://www.onsemi.com/pub_link/Collateral/59AA.PDF; ComponentLink2URL: http://www.onsemi.com/pub_link/Collateral/SA5.0A-D.PDF; Direction: Unidirectional; PackageDescription: 2-Pin, Axial Lead, Diameter 3.1 mm; PackageReference: AXIAL_LEAD-2-59AA-01; PartNumber: SA5.0A; ComponentLink1URL: http://www.onsemi.com/; Packing: Bulk Box; ComponentLink3Description: Package Specification; ComponentLink2Description: Datasheet; PackageVersion: Rev. A, 02/2007; DatasheetVersion: Rev. 13; ComponentLink1Description: Manufacturer URL
IC3 = CMP-0314-00015-2: I2C Bus Extender, 2 Channel Width, 3.0 to 12.0 V, -40 to 85 degC, 8-pin PDIP (P), Pb-Free (RoHS); Manufacturer: Texas Instruments; Master Side I2C Bus Capacitance Supported(pF): 400; VCC(Min)(V): 3; Open Drain I/O Type: Yes; Eco-Plan: Green (RoHS & no Sb/Br); Channel Width: 2; SubFamily: I2C Hub, Buffer, Repeater; VCC(Max)(V): 12; ComponentLink2URL: http://www.ti.com/litv/pdf/mpdi001b; Code_JEDEC: MS-001-BA; Vcc range(V): 3.0 to 12.0; PackageReference: P0008A; ComponentLink2Description: Package Specification; PackageVersion: revE, Apr-2010; Slave Side I2C Bus Capacitance Supported(pF): 400; ComponentLink1Description: Datasheet; Max Frequency(kHz): 400; ComponentLink1URL: http://www.ti.com/general/docs/lit/getliterature.tsp?genericPartNumber=P82B715&fileType=pdf; DatasheetVersion: SCPS145A; PartNumber: P82B715P; PackageDescription: 8-Pin Plastic Dual-In-Line Package, Row Spacing 7.62 mm, Pitch 2.54 mm; 5V Tolerant I/O: Yes; Mounting Technology: Through-hole
MOD1A MOD2 = CMP-1502-01349-1: as MOD1B on sheet Sheet1; Operating Temperature: -40to125degC; Manufacturer URL: http://www.we-online.de; Datasheet URL: https://katalog.we-online.de/em/datasheet/6130xx15721.pdf; Row Number: Single; Packaging: Tube; Orientation: Vertical; Publisher: WurthElektronik; Package Reference: 61302015721; Mounting Technology: THT; Part Number: 61302015721
P2 = CMP-07234-000024-1: TRIMMER 10K OHM 0.5W PC PIN TOP; Resistance: 10kR; Temperature Coefficient: 100ppm/°C; Power Rating: 500mW; Tolerance: 10%; Number of Turns: 25; Width: 0.19inch; Termination: Pin; Radiation Hardening: No; Contact Plating: Tin; Composition: Cermet; Length: 9.53mm; Height: 0.395inch; Depth: 4.83mm; REACH SVHC: No SVHC; Weight: 0.03oz; Min Operating Temperature: -55°C; Military Standard: Not; Max Operating Temperature: 125°C; Packaging: Tape and Reel; Package Quantity: 1; Taper: Linear; Max Power Dissipation: 500mW; Mount: Through Hole
R2 R3 = Res2: as R4 on sheet Sheet1; Published: 8-Jun-2000; LatestRevisionDate: 17-Jul-2002; LatestRevisionNote: Re-released for DXP Platform.; PackageReference: AXIAL-0.4; Publisher: Altium Limited; PackageDescription: Axial Device, Thru-Hole; 2 Leads; 0.4 in Pin Spacing; Supplier 1: Avnet; Manufacturer Part Number: CW010330R0JE12; RoHS: Yes; Category: Through-Hole Resistors; Pricing 1: 100=1,22562, 200=1,19564, 400=1,09480, 600=1,06352, 800=1,04006, 1000=1,01660, 10000=0,99314 (USD); Mount: Through Hole; Case/Package: Axial; Weight: 0.317466oz; Contact Plating: Tin,Matte; Min Operating Temperature: -65°C; Max Operating Temperature: 250°C; Tolerance: 5%; Resistor Type: Wirewound; Packaging: Bulk; Package Quantity: 100; Number of Terminations: 2; Termination: Axial; Max Power Dissipation: 10W; Features: Moisture Resistant; Diameter: 9.52mm; Length: 47.62mm; Radiation Hardening: No; Military Standard: Not; ComponentLink1URL: https://datasheet.ciiva.com/8453/cw-8453255.pdf?src-supplier=Avnet; ComponentLink1Description: https://datasheet.ciiva.com/8453/cw-8453255.pdf?src-supplier=Avnet; ComponentLink2URL: https://datasheet.ciiva.com/2761/cw-2761098.pdf?src-supplier=Digi-Key; ComponentLink2Description: https://datasheet.ciiva.com/2761/cw-2761098.pdf?src-supplier=Digi-Key
R7-R11 = Res2: as R12 on sheet Sheet1; Published: 8-Jun-2000; LatestRevisionDate: 17-Jul-2002; LatestRevisionNote: Re-released for DXP Platform.; PackageReference: AXIAL-0.4; Publisher: Altium Limited; PackageDescription: Axial Device, Thru-Hole; 2 Leads; 0.4 in Pin Spacing; Supplier 1: Digi-Key; RoHS: Yes; Category: Through-Hole Resistors; Stock 1: 1586; Pricing 1: 1=0,53000, 10=0,40700, 25=0,30960, 50=0,23000, 100=0,17110, 250=0,14456, 500=0,12390 (USD); Case/Package: Axial; Number of Pins: 2; Contact Plating: Tin,Matte; Weight: 0.009877oz; Min Operating Temperature: -55°C; Max Operating Temperature: 175°C; Tolerance: 1%; Power Rating: 500mW; Resistor Type: Metal Film; Packaging: Tape and Reel; Package Quantity: 1; Number of Terminations: 2; Max Power Dissipation: 500mW; Termination: Axial; Voltage Rating (DC): 250V; Features: Moisture Resistant,Flame Retardant Coating; Series: CMF; Diameter: 2.29mm; Length: 6.1mm; Width: 2.29mm; REACH SVHC: Unknown; RoHS Compliant: Yes; Lead Free: Lead Free; ComponentLink1URL: https://datasheet.ciiva.com/8821/cmfind-8821141.pdf?src-supplier=Avnet; ComponentLink1Description: https://datasheet.ciiva.com/8821/cmfind-8821141.pdf?src-supplier=Avnet; ComponentLink2URL: https://datasheet.ciiva.com/6532/cmfind-6532695.pdf?src-supplier=Digi-Key; ComponentLink2Description: https://datasheet.ciiva.com/6532/cmfind-6532695.pdf?src-supplier=Digi-Key; ComponentLink3URL: https://datasheet.ciiva.com/6532/cmfind-6532697.pdf?src-supplier=Digi-Key; ComponentLink3Description: https://datasheet.ciiva.com/6532/cmfind-6532697.pdf?src-supplier=Digi-Key; ComponentLink4URL: https://datasheet.ciiva.com/16436/cmfind-16436747.pdf?src-supplier=Future+Electronics; ComponentLink4Description: https://datasheet.ciiva.com/16436/cmfind-16436747.pdf?src-supplier=Future+Electronics
R14-R16 = Res2: as R17 on sheet Sheet1; Published: 8-Jun-2000; LatestRevisionDate: 17-Jul-2002; LatestRevisionNote: Re-released for DXP Platform.; PackageReference: AXIAL-0.4; Publisher: Altium Limited; PackageDescription: Axial Device, Thru-Hole; 2 Leads; 0.4 in Pin Spacing; Supplier 1: Digi-Key; RoHS: No; Category: Through-Hole Resistors; Stock 1: 976; Pricing 1: 1=0,66000, 10=0,47000, 25=0,36640, 50=0,31020, 100=0,24440, 250=0,20680, 500=0,16920 (USD); Mount: Through Hole; Case/Package: Axial; Contact Plating: Tin,Lead; Min Operating Temperature: -65°C; Max Operating Temperature: 175°C; Tolerance: 2%; Packaging: Tape and Reel; Resistor Type: Metal Film; Number of Terminations: 2; Package Quantity: 1000; Power Rating: 250mW; Series: Military, MIL-PRF-22684/01, RL07; Termination: Axial; Features: Moisture Resistant,Military,Flame Retardant Coating; Diameter: 2.29mm; Length: 0.24inch; Width: 2.29mm; RoHS Compliant: No; Lead Free: Contains Lead; Military Standard: MIL-PRF-22684; ComponentLink1URL: https://datasheet.ciiva.com/14072/cmfmil-14072105.pdf?src-supplier=Digi-Key; ComponentLink1Description: https://datasheet.ciiva.com/14072/cmfmil-14072105.pdf?src-supplier=Digi-Key
R25 = CMP-1659-00073-1: as R23 on sheet Sheet1; PackageDescription: 2-Pin Axial Lead, Dia 2.4 mm, Body Length 6.3 mm; PackageReference: MFR-25; Length: 0.248 inch; ComponentLink2Description: Datasheet; Packaging: Bulk; DatasheetVersion: Apr-13; Package Quantity: 200; Min Operating Temperature: -55 degC; ComponentLink2URL: http://www.yageo.com/documents/recent/Yageo%20LR_MFR_2013.pdf; RoHSCompliant: true; ComponentLink1URL: http://www.yageo.com/; Tolerance: 1%; Case\Package: Axial; Mount: Through Hole; ComponentLink1Description: Manufacturer URL; Max Operating Temperature: 155 degC
S1-S3 = CMP-1453-00013-1: WS-TATV THT Tact Switch 6X6 mm; Manufacturer: Wuerth Elektronik; NoPins: 04; PackageReference: 430186070716; ComponentLink2Description: Datasheet; ComponentLink1Description: Manufacturer URL; PartNumber: 430186070716; ComponentLink2URL: http://katalog.we-online.de/em/datasheet/4301x6.pdf; ComponentLink1URL: http://www.we-online.com
Sensor1-Sensor3 = CMP-02366-000003-1: CONN MOD JACK 8P8C R/A UNSHLD; Manufacturer: Amphenol; Current Rating: 1.5A; Voltage Rating: 125V; Pitch: 1.02mm; Conn Orientation: Right Angle; Number Of Contacts: 8; Is Female: yes; Conn Gender: Female; Lead Free: Yes; Device Class L3: unset; Footprint Url: https://cdn.amphenol-icc.com/media/wysiwyg/files/drawing/rjhse5080.pdf?__cf_chl_jschl_tk__=e349db0bbbb6188a39347cd5e541b92fa02c9719-1587748343-0-AW7tChdeHzRPLX9gSWj7WrKaXQoY9BsmT9Ek0h-T62M9y3Rs9iypFcOtkzb-6sGYQEjFE-jcoNciDETCOZrh1rYyOesac5SvYLoLwHIsHvF4AKBlx-MXmfZUVk9OTTJLqyQq2qMm0PFRLJpNcK0nrKResqOniRSYixG2sPTmOPraH-ULJFBDL602CHqcI9KKBgTq90Jh1OL2Td4moJ99rFsJRJ1Tk_uoxGe8ublcP_ARu-uLpWcQrBcwOcHDTAwL29DAwVaqcH7ta8Ks7WMlHmVl_pILeEDwT0bE9vu5Pa5S3PtNRF1leuFkgi_FMbUxTDulc5xzbXSfng8srUIV1lWXny5nx1fZJEUa_w97yKjffzBMxiWLWVN-V7-uqAaPbyv_m-wRyw5O25OZNyJOeGU; ComponentLink2URL: https://cdn.amphenol-icc.com/media/wysiwyg/files/documentation/datasheet/inputoutput/io-modjack-rjhse.pdf; Device Class L1: Connectors; Package: CONN_MOD_JACK; Mouser Description: Modular Connectors / Ethernet Connectors R/A RJ45 NONSHIELDED 8 CONT NO LEDS; Manufacturer Part Number: RJHSE-5080; Octopart: https://octopart.com/rjhse-5080-amphenol-45060; Category: Conn; Height: 0.535inch; Temperature: -55°C to +85°C; Digikey Description: CONN MOD JACK 8P8C R/A UNSHLD; Device Class L2: Modular / Ethernet Connectors; Contact Material: Gold,Nickel; ComponentLink2Description: Datasheet; Temperature Range Low: -55°C; RoHS: TRUE; Automotive: No; Temperature Range High: +85°C
T5 = CMP-1048-01467-1: as T2 on sheet Sheet1; DatasheetVersion: Rev. 7; ComponentLink1URL: http://www.onsemi.com/; Polarity: NPN; RoHS: FALSE; ComponentLink1Description: Manufacturer URL; Packing: Bulk Box; PackageDescription: 3-Pin Transistor Outline, Body 4.825 x 3.685 mm, Pitch 1.27 mm; ComponentLink3URL: http://www.onsemi.cn/pub_link/Collateral/2N6426-D.PDF; ComponentLink2Description: Datasheet; PackageVersion: Rev. AM; PackageReference: TO-92-3-29-11_AM_SL; ComponentLink3Description: Package Specification; Mounting Technology: Through Hole; PartNumber: BC547B; ComponentLink2URL: http://www.onsemi.com/pub_link/Collateral/BC546-D.PDF
T6 T7 = CMP-1058-00936-1: Small Signal MOSFET, 200 mA, 60 V, N-Channel, 3-Pin TO-92, Bulk Box; Manufacturer: On Semiconductor; Ciss Typ (pF): 60; VGS(th) Max (V): 3; Crss Typ (pF): 5; Channel Polarity: N Channel; VGS Max (V): 20; Configuration: Single; PD Max (W): 0.35; Coss Typ (pF): 25; ID Max (A): 0.2; PackageVersion: Rev. AM; ComponentLink3URL: http://www.onsemi.cn/pub_link/Collateral/2N6426-D.PDF; ComponentLink2URL: http://www.onsemi.com/pub_link/Collateral/2N7000-D.PDF; DatasheetVersion: Rev. 8; Mounting Technology: Through Hole; V(BR)DSS Min (V): 60; PartNumber: 2N7000; PackageDescription: 3-Pin Transistor Outline, Body 4.825 x 3.685 mm, Pitch 1.27 mm; ComponentLink2Description: Datasheet; ComponentLink1URL: http://www.onsemi.com/; PackageReference: TO-92-3-29-11_AM_SL; Packing: Bulk Box; ComponentLink1Description: Manufacturer URL; Package Type: TO-92; ComponentLink3Description: Package Specification